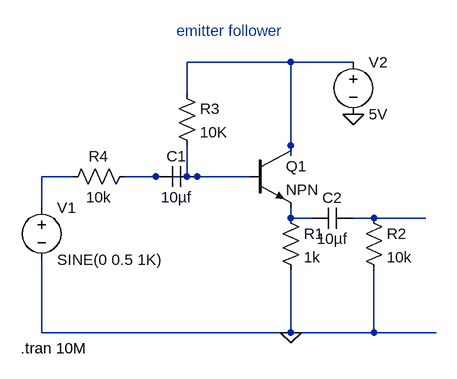
[diagram p0: schematic emitter follower.asc]
emitter follower.asc, the LTspice schematic file:
Version 4.1
SHEET 1 880 680
WIRE 288 -16 128 -16
WIRE 384 -16 288 -16
WIRE 128 32 128 -16
WIRE 288 112 288 -16
WIRE 288 128 288 112
WIRE -48 160 -96 160
WIRE 80 160 32 160
WIRE 128 160 128 112
WIRE 128 160 80 160
WIRE 144 160 128 160
WIRE 224 160 144 160
WIRE -96 208 -96 160
WIRE 288 224 288 208
WIRE 320 224 288 224
WIRE 416 224 384 224
WIRE 496 224 416 224
WIRE -96 400 -96 288
WIRE 288 400 288 304
WIRE 288 400 -96 400
WIRE 416 400 416 304
WIRE 416 400 288 400
WIRE 512 400 416 400
FLAG 384 64 0
FLAG 288 400 0
SYMBOL npn 224 112 R0
SYMATTR InstName Q1
SYMBOL res 272 208 R0
SYMATTR InstName R1
SYMATTR Value 1k
SYMBOL res 400 208 R0
SYMATTR InstName R2
SYMATTR Value 10k
SYMBOL res 112 16 R0
SYMATTR InstName R3
SYMATTR Value 10K
SYMBOL res 48 144 R90
WINDOW 0 0 56 VBottom 2
WINDOW 3 32 56 VTop 2
SYMATTR InstName R4
SYMATTR Value 10k
SYMBOL cap 144 144 R90
WINDOW 0 0 32 VBottom 2
WINDOW 3 32 32 VTop 2
SYMATTR InstName C1
SYMATTR Value 10µf
SYMBOL voltage -96 192 R0
WINDOW 123 0 0 Left 0
WINDOW 39 0 0 Left 0
SYMATTR InstName V1
SYMATTR Value SINE(0 0.5 1K)
SYMBOL voltage 384 -32 R0
WINDOW 123 0 0 Left 0
WINDOW 39 0 0 Left 0
SYMATTR InstName V2
SYMATTR Value 5V
SYMBOL cap 384 208 R90
WINDOW 0 0 32 VBottom 2
WINDOW 3 32 32 VTop 2
SYMATTR InstName C2
SYMATTR Value 10µf
TEXT -128 424 Left 2 !.tran 10M
TEXT 112 -64 Left 2 ;emitter follower

The netlist it stands for:
* emitter follower.asc
Q1 N001 N003 N004 0 NPN
R1 N004 0 1k
R2 N005 0 10k
R3 N001 N003 10K
R4 N003 N002 10k
C1 N003 N003 10µf
V1 N002 0 SINE(0 0.5 1K)
V2 N001 0 5V
C2 N005 N004 10µf
.model NPN NPN
.model PNP PNP
.lib standard.bjt
.tran 10M
* emitter follower
.backanno
.end